# Altium project Airbrake Motor Controller.PrjPcb
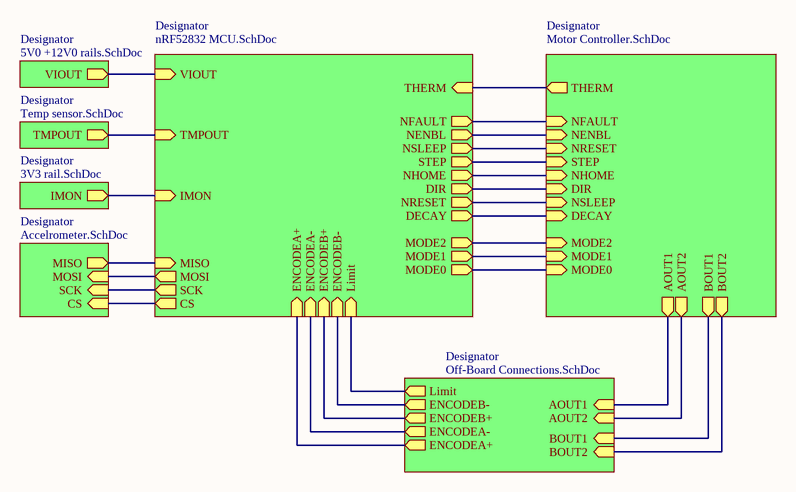
[diagram p0: Airbrake Motor Controller main.SchDoc]
8 sheets, 103 parts. Net scope: hierarchical (ports join the sheet entries above them; power ports are global).
Board file: Airbrake Motor Controller.PcbDoc
Sheets:
  Airbrake Motor Controller main.SchDoc
    Designator = 5V0 +12V0 rails.SchDoc
    Designator = 3V3 rail.SchDoc
    Designator = Motor Controller.SchDoc
    Designator = nRF52832 MCU.SchDoc
    Designator = Accelrometer.SchDoc
    Designator = Off-Board Connections.SchDoc
    Designator = Temp sensor.SchDoc

## Sheet Airbrake Motor Controller main.SchDoc
size A

### Sub-sheets
Designator = 5V0 +12V0 rails.SchDoc: VIOUT (out)
Designator = 3V3 rail.SchDoc: IMON (out)
Designator = Motor Controller.SchDoc: DIR (in), DECAY (in), NENBL (in), NFAULT (in), NHOME (in), NRESET (in), NSLEEP (in), STEP (in), MODE0 (in), MODE1 (in), MODE2 (in), THERM (out), BOUT1 (out), BOUT2 (out), AOUT1 (out), AOUT2 (out)
Designator = nRF52832 MCU.SchDoc: ENCODEA+ (in), ENCODEB+ (in), ENCODEA- (in), ENCODEB- (in), NFAULT (out), VIOUT (in), CS (out), NENBL (out), NSLEEP (out), STEP (out), SCK (out), MODE2 (out), MOSI (out), NHOME (out), MISO (in), TMPOUT (in), DIR (out), IMON (in), NRESET (out), MODE0 (out), THERM (in), DECAY (out), MODE1 (out), Limit (in)
Designator = Accelrometer.SchDoc: MOSI (in), CS (in), MISO (out), SCK (in)
Designator = Off-Board Connections.SchDoc: BOUT1 (in), ENCODEA- (out), ENCODEA+ (out), BOUT2 (in), ENCODEB- (out), ENCODEB+ (out), AOUT1 (in), AOUT2 (in), Limit (out)
Designator = Temp sensor.SchDoc: TMPOUT (out)

### Nets
NetC17_1: sheet Designator/TMPOUT, sheet Designator/TMPOUT
NetJ4_1: sheet Designator/AOUT1, sheet Designator/AOUT1
NetJ4_2: sheet Designator/AOUT2, sheet Designator/AOUT2
NetJ4_3: sheet Designator/BOUT2, sheet Designator/BOUT2
NetJ4_4: sheet Designator/BOUT1, sheet Designator/BOUT1
NetR2_1: sheet Designator/ENCODEA+, sheet Designator/ENCODEA+
NetR3_1: sheet Designator/ENCODEB+, sheet Designator/ENCODEB+
NetR6_1: sheet Designator/ENCODEA-, sheet Designator/ENCODEA-
NetR7_1: sheet Designator/ENCODEB-, sheet Designator/ENCODEB-
NetR27_2: sheet Designator/Limit, sheet Designator/Limit
NetR29_2: sheet Designator/NHOME, sheet Designator/NHOME
NetR30_2: sheet Designator/NFAULT, sheet Designator/NFAULT
NetU1_8: sheet Designator/MISO, sheet Designator/MISO
NetU1_9: sheet Designator/MOSI, sheet Designator/MOSI
NetU1_10: sheet Designator/SCK, sheet Designator/SCK
NetU1_11: sheet Designator/CS, sheet Designator/CS
NetU1_14: sheet Designator/MODE2, sheet Designator/MODE2
NetU1_15: sheet Designator/MODE1, sheet Designator/MODE1
NetU1_16: sheet Designator/MODE0, sheet Designator/MODE0
NetU1_17: sheet Designator/STEP, sheet Designator/STEP
NetU1_18: sheet Designator/NENBL, sheet Designator/NENBL
NetU1_19: sheet Designator/DIR, sheet Designator/DIR
NetU1_20: sheet Designator/DECAY, sheet Designator/DECAY
NetU1_23: sheet Designator/NSLEEP, sheet Designator/NRESET
NetU1_27: sheet Designator/NRESET, sheet Designator/NSLEEP
(unnamed): sheet Designator/VIOUT, sheet Designator/VIOUT
(unnamed): sheet Designator/IMON, sheet Designator/IMON
(unnamed): sheet Designator/THERM, sheet Designator/THERM

## Sheet 5V0 +12V0 rails.SchDoc
size A
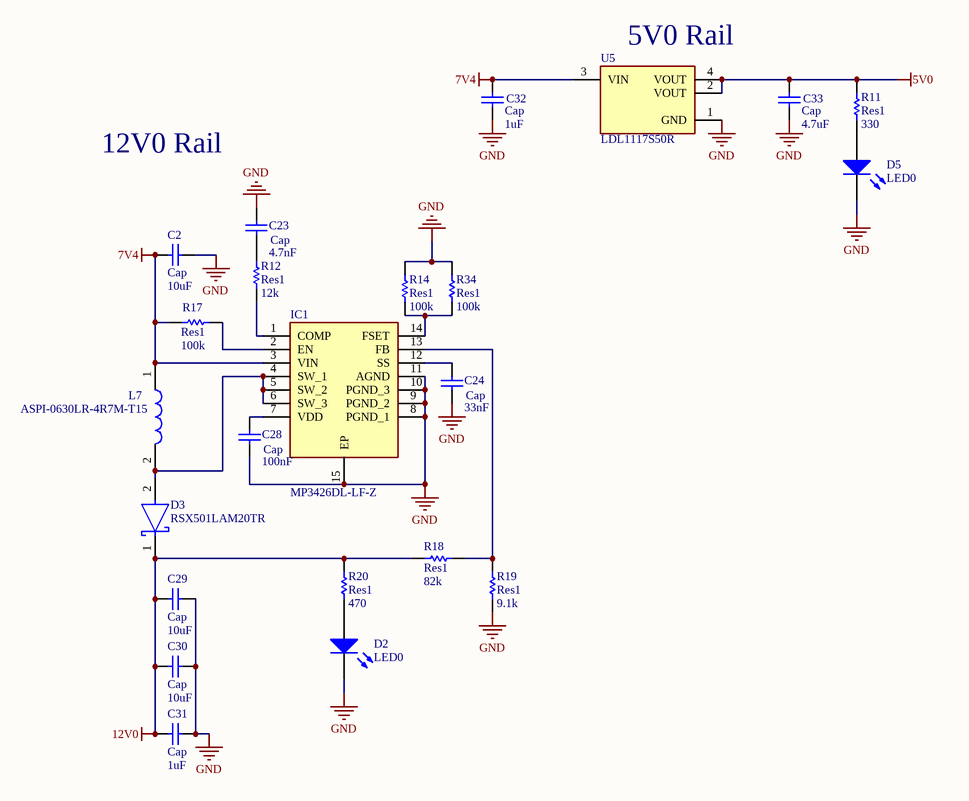
[diagram p1: 5V0 +12V0 rails.SchDoc]

### Parts
C2  Cap  value 10uF  [6-0805_M]
C23  Cap  value 4.7nF  [0402-A]
C24  Cap  value 33nF  [0402-A]
C28  Cap  value 100nF  [1608[0603]]
C29  Cap  value 10uF  [6-0805_M]
C30  Cap  value 10uF  [6-0805_M]
C31  Cap  value 1uF  [1608[0603]]
C32  Cap  value 1uF  [1608[0603]]
C33  Cap  value 4.7uF  [1608[0603]]
D2  LED0  [1608[0603]]
D3  RSX501LAM20TR  [FP-PMDTM-MFG]
D5  LED0  [1608[0603]]
IC1  MP3426DL-LF-Z  [SON50P300X400X100-15N-D]
L7  ASPI-0630LR-4R7M-T15  [ASPI-0630LR]
R11  Res1  value 330  [0402-A]
R12  Res1  value 12k  [0402-A]
R14  Res1  value 100k  [0402-A]
R17  Res1  value 100k  [0402-A]
R18  Res1  value 82k  [0402-A]
R19  Res1  value 9.1k  [0402-A]
R20  Res1  value 470  [6-0805_M]
R34  Res1  value 100k  [0402-A]
U5  LDL1117S50R  [FP-SOT-223-0046067_14-MFG]

### Nets
5V0: C33.2 R11.2 U5.2(VOUT) U5.4(VOUT)
7V4: C2.2 C32.2 IC1.3(VIN) L7.1 R17.2 U5.3(VIN)
12V0: C29.2 C30.2 C31.2 D3.1(C) R18.2 R20.2
GND: C2.1 C23.2 C24.1 C28.1 C29.1 C30.1 C31.1 C32.1 C33.1 D2.2(K) D5.2(K) IC1.8(PGND_1) IC1.9(PGND_2) IC1.10(PGND_3) IC1.11(AGND) IC1.15(EP) R14.1 R19.1 R34.1 U5.1(GND)
NetC23_1: C23.1 R12.1
NetC24_2: C24.2 IC1.12(SS)
NetC28_2: C28.2 IC1.7(VDD)
NetD2_1: D2.1(A) R20.1
NetD3_2: D3.2(A) IC1.4(SW_1) IC1.5(SW_2) IC1.6(SW_3) L7.2
NetD5_1: D5.1(A) R11.1
NetIC1_1: IC1.1(COMP) R12.2
NetIC1_2: IC1.2(EN) R17.1
NetIC1_13: IC1.13(FB) R18.1 R19.2
NetIC1_14: IC1.14(FSET) R14.2 R34.2

### Notes on the sheet
- (near U5) 5V0 Rail
- 12V0 Rail

### Library data of the parts
C2 C23 C24 C28-C33 = Cap: Capacitor; Published: 8-Jun-2000; LatestRevisionDate: 17-Jul-2002; LatestRevisionNote: Re-released for DXP Platform.; PackageReference: RAD-0.3; Publisher: Altium Limited; PackageDescription: Radial Cap, Thru-Hole; 2 Leads; 0.3 in Pin Spacing
D3 = CMP-08971-000008-1: DIODE SCHOTTKY 20V 5A PMDTM; Manufacturer: Rohm; Max Surge Forward Current: 100A; Max Junction Temp: +125°C; Max Repetitive Reverse Voltage: 25V; Peak Reverse Current: 500uA; Automotive: No; Digikey Description: DIODE SCHOTTKY 20V 5A PMDTM; Temperature Range High: +125°C; Height: 1.05mm; Octopart: https://octopart.com/rsx501lam20tr-rohm-82270774; Lead Free: Yes; ComponentLink2URL: https://fscdn.rohm.com/en/products/databook/datasheet/discrete/diode/schottky_barrier/rsx501lam20tr-e.pdf; Device Class L2: Diodes; ComponentLink2Description: Datasheet; Device Class L1: Discrete Semiconductors; RoHS: TRUE; Reverse Voltage: 20V; Package: PMDTM; Category: Diode; Temperature: to +125°C; Device Class L3: Schottky Diodes; Manufacturer Part Number: RSX501LAM20TR; Forward Current: 5A
IC1 = MP3426DL-LF-Z: Integrated Circuit; Manufacturer_Name: Monolithic Power Systems (MPS); Datasheet Link: https://www.monolithicpower.com/en/documentview/productdocument/index/version/2/document_type/Datasheet/lang/en/sku/MP3426/; Height: 1mm; Manufacturer_Part_Number: MP3426DL-LF-Z; Mouser Part Number: 946-MP3426DL-LF-Z; Mouser Price/Stock: https://www.mouser.co.uk/ProductDetail/Monolithic-Power-Systems-MPS/MP3426DL-LF-Z?qs=Z3CaLxJiOJL0MxCuEKYvhQ%3D%3D
L7 = ASPI-0630LR-4R7M-T15: Inductor; Manufacturer_Name: ABRACON; Datasheet Link: http://www.abracon.com/Magnetics/power/ASPI-0630LR.pdf; Manufacturer_Part_Number: ASPI-0630LR-4R7M-T15; Mouser Part Number: 815-ASPI0630LR4R7T15; Mouser Price/Stock: https://www.mouser.co.uk/ProductDetail/ABRACON/ASPI-0630LR-4R7M-T15?qs=bWAYEm3xoCYVuRmkzS1c6A%3D%3D; Arrow Part Number: ASPI-0630LR-4R7M-T15; Arrow Price/Stock: https://www.arrow.com/en/products/aspi-0630lr-4r7m-t15/abracon
R11 R12 R14 R17-R20 R34 = Res1: Resistor; Published: 8-Jun-2000; LatestRevisionDate: 17-Jul-2002; LatestRevisionNote: Re-released for DXP Platform.; PackageReference: AXIAL-0.3; Publisher: Altium Limited; PackageDescription: Axial Device, Thru-Hole; 2 Leads; 0.3 in Pin Spacing
U5 = CMP-12153-000005-1: IC REG LINEAR 5V 1.2A SOT223; Manufacturer: STMicroelectronics; Standoff Height: 0.02mm; Min Supply Voltage: 2.6V; Nominal Supply Current: 250uA; Max Junction Temp: +150°C; Accuracy Percentage: 2%; Output Type: Fixed; Max Supply Voltage: 18V; Output Current: 2A; Number Of Outputs: 1; Dropout Voltage: 350mV; ComponentLink2Description: Datasheet; Temperature Range High: +125°C; Manufacturer Part Number: LDL1117S50R; Digikey Description: IC REG LINEAR 5V 1.2A SOT223; Device Class L2: Power Management ICs; RoHS: TRUE; Temperature: -40°C to +125°C; Device Class L3: Voltage Regulators - Linear; Automotive: No; Mouser Description: LDL1117 Series 1.2 A 5 V High PSRR LDO Linear Voltage Regulator - SOT-223; Package: SOT-223-0046067_14; ComponentLink2URL: https://www.st.com/content/ccc/resource/technical/document/datasheet/group3/0e/5a/00/ca/10/1a/4f/a5/DM00366442/files/DM00366442.pdf/jcr:content/translations/en.DM00366442.pdf; Output Voltage: 5V; Octopart: https://octopart.com/ldl1117s50r-stmicroelectronics-81876164; Category: IC; Device Class L1: Integrated Circuits (ICs); Temperature Range Low: -40°C; Height: 1.9mm; Lead Free: Yes
D2 D5 = LED0: Published: 8-Jun-2000; LatestRevisionDate: 08-Jul-2005; LatestRevisionNote: Mech Layer 1 removed.; PackageReference: LED-0; Publisher: Altium Limited; PackageDescription: LED; 2 Leads

## Sheet 3V3 rail.SchDoc
size A
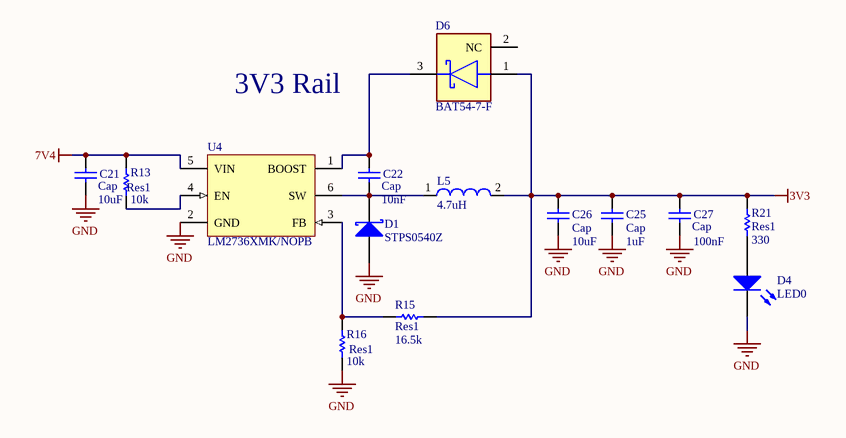
[diagram p2: 3V3 rail.SchDoc]

### Parts
C21  Cap  value 10uF  [6-0805_M]
C22  Cap  value 10nF  [0402-A]
C25  Cap  value 1uF  [1608[0603]]
C26  Cap  value 10uF  [6-0805_M]
C27  Cap  value 100nF  [1608[0603]]
D1  STPS0540Z  [STM-SOD-123-2_V]
D4  LED0  [1608[0603]]
D6  BAT54-7-F  [FP-SOT23-MFG]
L5  4.7uH  [WE-TPC-4818-M]
R13  Res1  value 10k  [0402-A]
R15  Res1  value 16.5k  [0402-A]
R16  Res1  value 10k  [0402-A]
R21  Res1  value 330  [0402-A]
U4  LM2736XMK/NOPB  [DDC0006A_L]

### Nets
3V3: C25.2 C26.2 C27.2 D6.1(A) L5.2 R15.1 R21.2
7V4: C21.2 R13.2 U4.5(VIN)
GND: C21.1 C25.1 C26.1 C27.1 D1.1(A) D4.2(K) R16.1 U4.2(GND)
NetC22_1: C22.1 D1.2(K) L5.1 U4.6(SW)
NetC22_2: C22.2 D6.3(C) U4.1(BOOST)
NetD4_1: D4.1(A) R21.1
NetR13_1: R13.1 U4.4(EN)
NetR15_2: R15.2 R16.2 U4.3(FB)

Not connected (* = marked no-connect by the designer): D6 2(NC)

### Notes on the sheet
- 3V3 Rail

### Library data of the parts
C21 C22 C25-C27 = Cap: Capacitor; Published: 8-Jun-2000; LatestRevisionDate: 17-Jul-2002; LatestRevisionNote: Re-released for DXP Platform.; PackageReference: RAD-0.3; Publisher: Altium Limited; PackageDescription: Radial Cap, Thru-Hole; 2 Leads; 0.3 in Pin Spacing
D1 = CMP-2000-07170-1: Schottky Rectifier, 0.5 A, 40 V, 2-Pin SOP (SOD-123), RoHS, Tape and Reel; Manufacturer: STMicroelectronics; SVHC: NoSVHC(15-Jun-2015); Forward Current If(AV): 500mA; Forward Voltage VF Max: 500mV; Repetitive Reverse Voltage Vrrm Max: 40V; No. of Pins: 2Pins; Forward Surge Current Ifsm Max: 5.5A; Diode Configuration: Single; Packaging: CutTape; Datasheet Version: 01/2002; Package Reference: SOD-123-2; Package Description: 2-Pin Small Outline Diode, Body 2.7 x 1.55 mm; Manufacturer URL: http://www.st.com/; Mounting Technology: SurfaceMount; Product Range: -; Operating Temperature Max: 150°C; Diode Case Style: SOD-123; Diode Type: Schottky; Datasheet URL: http://www.st.com/content/ccc/resource/technical/document/datasheet/group1/0f/03/9b/7c/50/58/48/d7/CD00001852/files/CD00001852.pdf/jcr:content/translations/en.CD00001852.pdf
D6 = CMP-0303-00002-2: DIODE SCHOTTKY 30V 200MA SOT23-3; Manufacturer: Diodes Inc.; Value: 10pF; Automotive Grade: NA; Max Junction Temp: +150°C; Peak Reverse Current: 2uA; Max Surge Forward Current: 600mA; Standoff Height: 0.013mm; Max Repetitive Reverse Voltage: 30V; Automotive: No; Package: SOT23; Category: Diode; Digikey Description: DIODE SCHOTTKY 30V 200MA SOT23-3; RoHS: TRUE; Temperature Range Low: -65°C; Device Class L3: Schottky Diodes; Footprint Url: https://www.diodes.com/assets/Package-Files/SOT23.pdf; Forward Current: 200mA; Reverse Voltage: 30V; Manufacturer Part Number: BAT54-7-F; Octopart: https://octopart.com/bat54-7-f-diodes+inc.-39681803; Lead Free: Yes; Temperature Range High: +150°C; ComponentLink2Description: Datasheet; Height: 1.1mm; Capacitance: 10pF; ComponentLink2URL: https://www.diodes.com/assets/Datasheets/ds11005.pdf; Temperature: -65°C to +150°C; Device Class L1: Discrete Semiconductors; Device Class L2: Diodes; Mouser Description: Switching diode SOT-23 30 V 200 mA
L5 = CMP-0227-00330-1: SMD Shielded Tiny Power Inductor WE-TPC, L = 4.70 µH; Inductance: 4.70 ÂµH; PackageVersion: 2010; ComponentLink2Description: Datasheet; ComponentLink2URL: http://www.we-online.de/katalog/media/pdf/744042004.pdf; PackageDescription: SMD Inductor, 2-Leads, Body 4.8 x 4.8 mm; ComponentLink1URL: http://www.we-online.com; PackageReference: WE-TPC-4818-M; ComponentLink1Description: Manufacturer Link; DatasheetVersion: ver 6, Aug-2010
R13 R15 R16 R21 = Res1: Resistor; Published: 8-Jun-2000; LatestRevisionDate: 17-Jul-2002; LatestRevisionNote: Re-released for DXP Platform.; PackageReference: AXIAL-0.3; Publisher: Altium Limited; PackageDescription: Axial Device, Thru-Hole; 2 Leads; 0.3 in Pin Spacing
U4 = CMP-0069-01211-3: 750mA Load Step-Down DC-DC Regulator, 6-pin Tiny SOT23, Pb-Free; Manufacturer: Texas Instruments; PowerWise: N; CompType: Switcher; PackageTopMarking: SHAB*XTT; Code_IPC: SOT26A-6; PackageDescription: Molded TSOT, 2.97 x 1.65 x 0.87mm Body, 6 Lead, 0.95mm Pitch; ComponentLink1Description: Datasheet URL; RoHS: Y; ComponentLink1URL: http://www.ti.com/general/docs/lit/getliterature.tsp?genericPartNumber=LM2736&fileType=pdf; PinCount: 6; PackageReference: DDC0006A; Code_JEDEC: MO-193-AA
D4 = LED0: Published: 8-Jun-2000; LatestRevisionDate: 08-Jul-2005; LatestRevisionNote: Mech Layer 1 removed.; PackageReference: LED-0; Publisher: Altium Limited; PackageDescription: LED; 2 Leads

## Sheet Motor Controller.SchDoc
size A
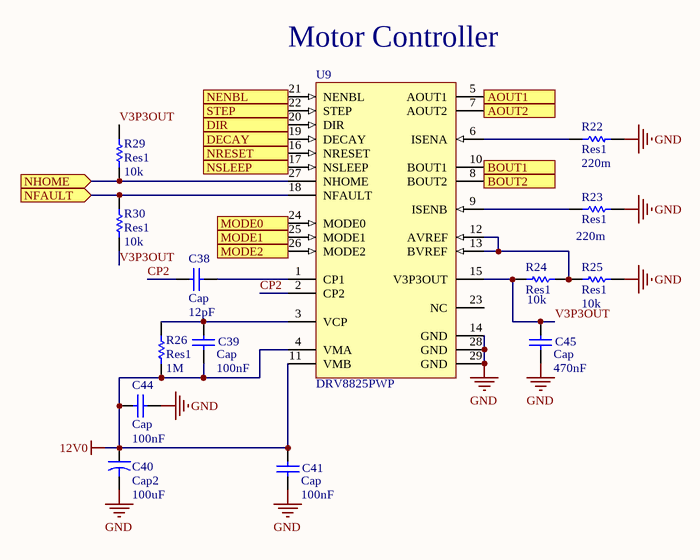
[diagram p3: Motor Controller.SchDoc]

### Parts
C38  Cap  value 12pF  [0402-A]
C39  Cap  value 100nF  [1608[0603]]
C40  Cap2  value 100uF  [RAD-0.1]
C41  Cap  value 100nF  [1608[0603]]
C44  Cap  value 100nF  [1608[0603]]
C45  Cap  value 470nF  [1608[0603]]
R22  Res1  value 220m  [RC2512N_PAN]
R23  Res1  value 220m  [RC2512N_PAN]
R24  Res1  value 10k  [0402-A]
R25  Res1  value 10k  [0402-A]
R26  Res1  value 1M  [0402-A]
R29  Res1  value 10k  [0402-A]
R30  Res1  value 10k  [0402-A]
U9  DRV8825PWP  [PWP0028C_L]

### Ports
AOUT1 (out), AOUT2 (out), BOUT1 (out), BOUT2 (out), DECAY (in), DIR (in), MODE0 (in), MODE1 (in), MODE2 (in), NENBL (in), NFAULT (in), NHOME (in), NRESET (in), NSLEEP (in), STEP (in)

### Nets
12V0: C39.1 C40.1 C41.2 C44.2 R26.1 U9.4(VMA) U9.11(VMB)
GND: C40.2 C41.1 C44.1 C45.1 R22.1 R23.1 R25.2 U9.14(GND) U9.28(GND) U9.29(GND)
CP2: C38.2 U9.2(CP2)
V3P3OUT: C45.2 R24.2 R29.1 R30.1 U9.15(V3P3OUT)
NetC38_1: C38.1 U9.1(CP1)
NetC39_2: C39.2 R26.2 U9.3(VCP)
NetJ4_1: U9.5(AOUT1) ; port AOUT1
NetJ4_2: U9.7(AOUT2) ; port AOUT2
NetJ4_3: U9.8(BOUT2) ; port BOUT2
NetJ4_4: U9.10(BOUT1) ; port BOUT1
NetR22_2: R22.2 U9.6(ISENA)
NetR23_2: R23.2 U9.9(ISENB)
NetR24_1: R24.1 R25.1 U9.12(AVREF) U9.13(BVREF)
NetR29_2: R29.2 U9.27(NHOME) ; port NHOME
NetR30_2: R30.2 U9.18(NFAULT) ; port NFAULT
NetU1_14: U9.26(MODE2) ; port MODE2
NetU1_15: U9.25(MODE1) ; port MODE1
NetU1_16: U9.24(MODE0) ; port MODE0
NetU1_17: U9.22(STEP) ; port STEP
NetU1_18: U9.21(NENBL) ; port NENBL
NetU1_19: U9.20(DIR) ; port DIR
NetU1_20: U9.19(DECAY) ; port DECAY
NetU1_23: U9.17(NSLEEP) ; port NSLEEP
NetU1_27: U9.16(NRESET) ; port NRESET

Not connected (* = marked no-connect by the designer): U9 23(NC)

### Notes on the sheet
- (near U9) Motor Controller

### Library data of the parts
C38 C39 C41 C44 C45 = Cap: Capacitor; Published: 8-Jun-2000; LatestRevisionDate: 17-Jul-2002; LatestRevisionNote: Re-released for DXP Platform.; PackageReference: RAD-0.3; Publisher: Altium Limited; PackageDescription: Radial Cap, Thru-Hole; 2 Leads; 0.3 in Pin Spacing
C40 = Cap2: Capacitor; Published: 23-Sep-2002; PackageReference: CAPR5-4X5; Publisher: Altium Limited; PackageDescription: Capacitor; 2 Leads
R22-R26 R29 R30 = Res1: Resistor; Published: 8-Jun-2000; LatestRevisionDate: 17-Jul-2002; LatestRevisionNote: Re-released for DXP Platform.; PackageReference: AXIAL-0.3; Publisher: Altium Limited; PackageDescription: Axial Device, Thru-Hole; 2 Leads; 0.3 in Pin Spacing
U9 = CMP-1685-00019-1: Stepper Motor Controller IC, 8.2 to 45 V, -40 to 85 degC, 28-Pin HTSSOP (PWP), Green (RoHS & no Sb/Br), Tube; Voltage Rating: 100 V; Tolerance: 20%; Capacitance: 47 uF; Case\Package: Radial; ComponentLink2URL: http://www.ti.com/general/docs/lit/getliterature.tsp?genericPartNumber=DRV8825&fileType=pdf; Voltage Rating (DC): 100 V; Lead Pitch: 3.5 mm; Diameter: 8 mm; DatasheetVersion: SLVSA73F, 07/2014; ComponentLink2Description: Datasheet; Package Quantity: 200; PackageDescription: 28-Pin Small Outline Package Integrated Circuit, Body 9.7 x 4.4 mm, Pitch 0.65 mm; Packaging: Bulk; Pins: 2; Min Operating Temperature: -40 degC; Width: 8 mm; ComponentLink1Description: Manufacturer URL; Length: 11.5 mm; Max Operating Temperature: 85 degC; Height: 11.5 mm; REACH SVHC: No SVHC; Mount: Through Hole; PackageReference: PWP0028C; RoHSCompliant: true; Radiation Hardening: No; ComponentLink1URL: http://www.ti.com/

## Sheet nRF52832 MCU.SchDoc
size A
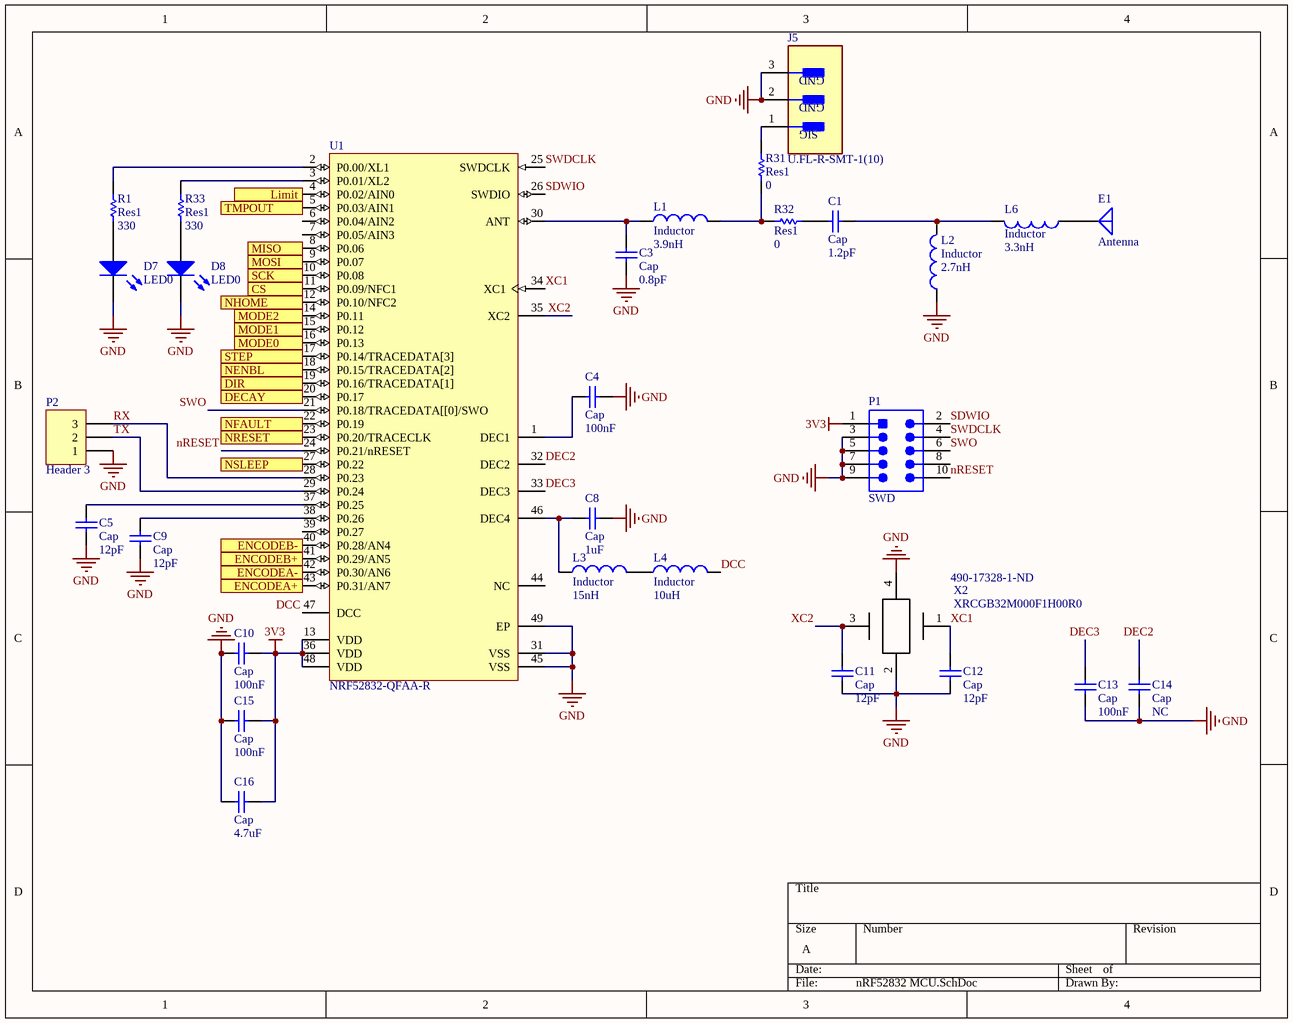
[diagram p4: nRF52832 MCU.SchDoc]

### Parts
C1  Cap  value 1.2pF  [0402-A]
C3  Cap  value 0.8pF  [0402-A]
C4  Cap  value 100nF  [1608[0603]]
C5  Cap  value 12pF  [0402-A]
C8  Cap  value 1uF  [1608[0603]]
C9  Cap  value 12pF  [0402-A]
C10  Cap  value 100nF  [1608[0603]]
C11  Cap  value 12pF  [0402-A]
C12  Cap  value 12pF  [0402-A]
C13  Cap  value 100nF  [1608[0603]]
C14  Cap  value NC  [0402-A]
C15  Cap  value 100nF  [1608[0603]]
C16  Cap  value 4.7uF  [6-0805_M]
D7  LED0  [1608[0603]]
D8  LED0  [1608[0603]]
E1  Antenna  [3.2X1.6X1.1]
J5  U.FL-R-SMT-1(10)  [FP-U_FL-R-SMT-1_10-MFG]
L1  Inductor  value 3.9nH  [0402-A]
L2  Inductor  value 2.7nH  [0402-A]
L3  Inductor  value 15nH  [0402-A]
L4  Inductor  value 10uH  [1608[0603]]
L6  Inductor  value 3.3nH  [0402-A]
P1  SWD  [SMTC-FTSH-105-01-L-DV-K_V]
P2  Header 3  [HDR1X3]
R1  Res1  value 330  [0402-A]
R31  Res1  value 0  [0402-A]
R32  Res1  value 0  [0402-A]
R33  Res1  value 330  [0402-A]
U1  NRF52832-QFAA-R  [NRSC-QF-48_M]
X2  XRCGB32M000F1H00R0  Supplier Part Number 1: 490-17328-1-ND  [XRCGB32M000F1H00R0]

### Ports
CS (out), DECAY (out), DIR (out), ENCODEA+ (in), ENCODEA- (in), ENCODEB+ (in), ENCODEB- (in), Limit (in), MISO (in), MODE0 (out), MODE1 (out), MODE2 (out), MOSI (out), NENBL (out), NFAULT (out), NHOME (out), NRESET (out), NSLEEP (out), SCK (out), STEP (out), TMPOUT (in)

### Nets
3V3: C10.1 C15.1 C16.1 P1.1 U1.13(VDD) U1.36(VDD) U1.48(VDD)
GND: C3.1 C4.1 C5.2 C8.1 C9.2 C10.2 C11.1 C12.1 C13.2 C14.2 C15.2 C16.2 D7.2(K) D8.2(K) J5.2(GND) J5.3(GND) L2.1 P1.3 P1.5 P1.7 P1.9 P2.1 U1.31(VSS) U1.45(VSS) U1.49(EP) X2.2 X2.4
DCC: L4.2 U1.47(DCC)
DEC2: C14.1 U1.32(DEC2)
DEC3: C13.1 U1.33(DEC3)
nRESET: P1.10 U1.24(P0.21/nRESET)
RX: P2.3 U1.28(P0.23)
SDWIO: P1.2 U1.26(SWDIO)
SWDCLK: P1.4 U1.25(SWDCLK)
SWO: P1.6 U1.21(P0.18/TRACEDATA[[0]/SWO)
TX: P2.2 U1.29(P0.24)
XC1: C12.2 U1.34(XC1) X2.1
XC2: C11.2 U1.35(XC2) X2.3
NetC1_1: C1.1 L2.2 L6.2
NetC1_2: C1.2 R32.2
NetC3_2: C3.2 L1.1 U1.30(ANT)
NetC4_2: C4.2 U1.1(DEC1)
NetC5_1: C5.1 U1.37(P0.25)
NetC8_2: C8.2 L3.1 U1.46(DEC4)
NetC9_1: C9.1 U1.38(P0.26)
NetC17_1: U1.5(P0.03/AIN1) ; port TMPOUT
NetD7_1: D7.1(A) R1.1
NetD8_1: D8.1(A) R33.1
NetE1_1: E1.1(A) L6.1
NetJ5_1: J5.1(SIG) R31.2
NetL1_2: L1.2 R31.1 R32.1
NetL3_2: L3.2 L4.1
NetR1_2: R1.2 U1.2(P0.00/XL1)
NetR2_1: U1.43(P0.31/AN7) ; port ENCODEA+
NetR3_1: U1.41(P0.29/AN5) ; port ENCODEB+
NetR6_1: U1.42(P0.30/AN6) ; port ENCODEA-
NetR7_1: U1.40(P0.28/AN4) ; port ENCODEB-
NetR27_2: U1.4(P0.02/AIN0) ; port Limit
NetR29_2: U1.12(P0.10/NFC2) ; port NHOME
NetR30_2: U1.22(P0.19) ; port NFAULT
NetR33_2: R33.2 U1.3(P0.01/XL2)
NetU1_8: U1.8(P0.06) ; port MISO
NetU1_9: U1.9(P0.07) ; port MOSI
NetU1_10: U1.10(P0.08) ; port SCK
NetU1_11: U1.11(P0.09/NFC1) ; port CS
NetU1_14: U1.14(P0.11) ; port MODE2
NetU1_15: U1.15(P0.12) ; port MODE1
NetU1_16: U1.16(P0.13) ; port MODE0
NetU1_17: U1.17(P0.14/TRACEDATA[3]) ; port STEP
NetU1_18: U1.18(P0.15/TRACEDATA[2]) ; port NENBL
NetU1_19: U1.19(P0.16/TRACEDATA[1]) ; port DIR
NetU1_20: U1.20(P0.17) ; port DECAY
NetU1_23: U1.23(P0.20/TRACECLK) ; port NRESET
NetU1_27: U1.27(P0.22) ; port NSLEEP

Not connected (* = marked no-connect by the designer): P1 8; U1 6(P0.04/AIN2) 7(P0.05/AIN3) 39(P0.27) 44(NC)

### Library data of the parts
C1 C3-C5 C8-C16 = Cap: Capacitor; Published: 8-Jun-2000; LatestRevisionDate: 17-Jul-2002; LatestRevisionNote: Re-released for DXP Platform.; PackageReference: RAD-0.3; Publisher: Altium Limited; PackageDescription: Radial Cap, Thru-Hole; 2 Leads; 0.3 in Pin Spacing
E1 = Antenna: Generic Antenna; Published: 24-Mar-1999; LatestRevisionDate: 17-Jul-2002; LatestRevisionNote: Re-released for DXP Platform.; PackageReference: PIN1; Publisher: Altium Limited
J5 = CMP-2000-05152-2: CONN U.FL RCPT STR 50 OHM SMD; Body Plating: Silver; Impedance: 50R; Frequency: 6GHz; Connector Type: Coaxial; Dielectric Material: Polymer; Insulation Resistance: 500MR; Body Material: Bronze; Gender: Male; REACH SVHC: No SVHC; Depth: 3.1mm; Housing Color: Beige; Contact Material: Brass; Package Quantity: 2500; Max Frequency: 6GHz; Radiation Hardening: No; Packaging: Tape and Reel; Termination: Solder; Lead Free: Lead Free; Wire/Cable Type: Coaxial; Min Operating Temperature: -40°C; Max Operating Temperature: 90°C; Contact Plating: Gold; Mount: Surface Mount; Fastening Type: Snap; Orientation: Straight; Length: 3mm
L1-L4 L6 = Inductor: Code_IEC: 1005; Published: 8-Jun-2000; LatestRevisionDate: 29-May-2009; LatestRevisionNote: IPC-7351 Footprint Added.; PackageReference: 0402-A; Publisher: Altium Limited; PackageDescription: Chip Inductor; Code_JEITA: 0402
P1 = CMP-2000-05353-1: Male Header, Pitch 1.27 mm, 2 x 5 Position, Height 6.25 mm; Manufacturer: Samtec; Pitch: 0.050"(1.27mm); Other Names: Q3937619; Number of Positions: 10; Mating Products: SFMC-105-L2-S-D-TR-ND / -CONN.05"SURFACE10POSSMT / FLE-105-01-G-DV-TR-ND / -CONNSKT1.27MM10POSDUALSMD / FLE-105-01-G-DV-A-P-ND / -CONNSKT1.27MM10POSDUALSMD / FLE-105-01-G-DV-A-ND / -CONNSKT1.27MM10POSDUALSMD / CLP-105-02-G-D-P-TR-ND / -CONNRCPT10POSDUAL.05"SMD / SAM1155-05-ND / -CONNRCPT10POSDUAL.05"SMD / SAM1154-05-ND / -CONNRCPT10POSDUAL.05"SMD / SAM1153-05-ND / -CONNRCPT10POSDUAL.05"SMD / SAM1226-05-ND / -CONNRCPT.05"10POSDUALSMD; Number of Positions Loaded: All; Connector Type: Header,Unshrouded; Product Training Modules: Board-to-BoardConnectors; Datasheet Version: Rev. ET, 10/1995; Number of Rows: 2; Standard Package: 1; Package Description: Male Header, Pitch 1.27 mm, 2 x 5 Position, Height 5.97 mm, Tail Length 4.32 mm; Contact Finish Thickness: 10µin(0.25µm); Series: FTSH; Termination: Solder; Contact Type: MalePin; Color: Black; Package Reference: FTSH-105-01-L-DV-K; Family: RectangularConnectors-Headers,MalePins; Package URL: http://suddendocs.samtec.com/prints/ftsh-1xx-xx-xxx-dv-xxx-footprint.pdf; Packaging: Tube; Mounting Type: SurfaceMount; Category: Connectors,Interconnects; Datasheet URL: http://suddendocs.samtec.com/prints/ftsh-1xx-xx-xxx-dv-xxx-mkt.pdf; Row Spacing: 0.050"(1.27mm); Manufacturer URL: http://www.samtec.com/; Contact Mating Length: 0.120"(3.05mm); Contact Finish: Gold
P2 = Header 3: Header, 3-Pin; LatestRevisionDate: 17-Jul-2002; LatestRevisionNote: Re-released for DXP Platform.; Publisher: Altium Limited
R1 R31-R33 = Res1: Resistor; Published: 8-Jun-2000; LatestRevisionDate: 17-Jul-2002; LatestRevisionNote: Re-released for DXP Platform.; PackageReference: AXIAL-0.3; Publisher: Altium Limited; PackageDescription: Axial Device, Thru-Hole; 2 Leads; 0.3 in Pin Spacing
U1 = CMP-2100-03661-1: Multiprotocol Bluetooth Smart, ANT/ANT+ and Proprietary System-on-Chip, 2.4 GHz, 256 KB FLASH, 1.7 to 3.6 V, -40 to 85 degC, 48-Pin QFN, RoHS, Tape and Reel; Manufacturer: Nordic Semiconductor; Frequency: 2.4GHz; Datasheet Version: Rev. 1.0, 02/2016; Datasheet URL: http://infocenter.nordicsemi.com/pdf/nRF52832_PS_v1.0.pdf; Mount: SurfaceMount; Max Operating Temperature: 85degC; Manufacturer URL: http://www.nordicsemi.com/eng/Products/; Lead Free: LeadFree; Min Operating Temperature: -40degC; RoHSCompliant: true; Package Reference: QF-48; Package Description: 48-Pin Quad Flat No-lead Package, Body 6 x 6 mm, Pitch 0.4 mm, Thermal Pad 4.6 x 4.6 mm; Max Frequency: 2.4GHz; Packaging: TapeandReel
X2 = XRCGB32M000F1H00R0: 32MHz Crystal Oscillator; Supplier 1: Digi-Key
D7 D8 = LED0: Published: 8-Jun-2000; LatestRevisionDate: 08-Jul-2005; LatestRevisionNote: Mech Layer 1 removed.; PackageReference: LED-0; Publisher: Altium Limited; PackageDescription: LED; 2 Leads

## Sheet Accelrometer.SchDoc
size A
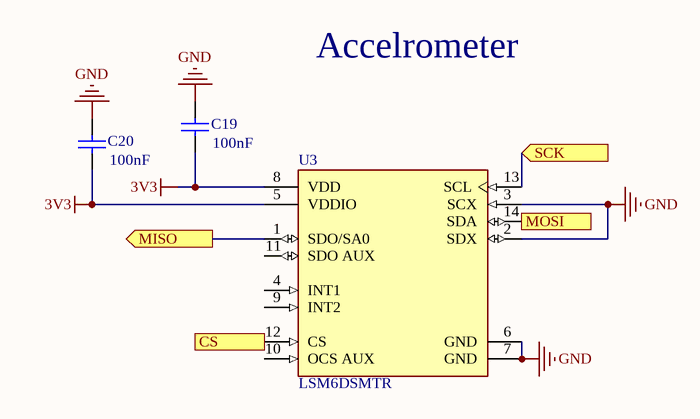
[diagram p5: Accelrometer.SchDoc]

### Parts
C19  value 100nF  [1608[0603]]  (hidden comment: Cap)
C20  value 100nF  [1608[0603]]  (hidden comment: Cap)
U3  LSM6DSMTR  [FP-LGA-14L-DM00249496-MFG]

### Ports
CS (in), MISO (out), MOSI (in), SCK (in)

### Nets
3V3: C19.2 C20.2 U3.5(VDDIO) U3.8(VDD)
GND: C19.1 C20.1 U3.2(SDX) U3.3(SCX) U3.6(GND) U3.7(GND)
NetU1_8: U3.1(SDO/SA0) ; port MISO
NetU1_9: U3.14(SDA) ; port MOSI
NetU1_10: U3.13(SCL) ; port SCK
NetU1_11: U3.12(CS) ; port CS

Not connected (* = marked no-connect by the designer): U3 4(INT1) 9(INT2) 10(OCS_AUX) 11(SDO_AUX)

### Notes on the sheet
- Accelrometer

### Library data of the parts
C19 C20 = Cap: Capacitor; Published: 8-Jun-2000; LatestRevisionDate: 17-Jul-2002; LatestRevisionNote: Re-released for DXP Platform.; PackageReference: RAD-0.3; Publisher: Altium Limited; PackageDescription: Radial Cap, Thru-Hole; 2 Leads; 0.3 in Pin Spacing
U3 = CMP-12177-000008-1: IMU ACCEL/GYRO I2C/SPI 14LGA; Manufacturer: STMicroelectronics; Operating Supply Current: 0.29-0.65mA; Gyro Range: 125/250/500/1000/2000°/s; Sensor Output: I2C,SPI; Accel Range: 2/4/8/16g; Min Supply Voltage: 1.62V; Resolution: 16bits; Sensor Type: Temperature,Accelerometer,Gyroscope; Max Supply Voltage: 3.6V; Manufacturer Part Number: LSM6DSMTR; Octopart: https://octopart.com/lsm6dsmtr-stmicroelectronics-66358194; Height: 0.86mm; Category: IC; Lead Free: Yes; Temperature: -40°C to +85°C; Temperature Range Low: -40°C; ComponentLink2Description: Datasheet; ComponentLink2URL: https://www.st.com/resource/en/datasheet/lsm6dsm.pdf; Digikey Description: IMU ACCEL/GYRO I2C/SPI 14LGA; Footprint Url: https://www.st.com/content/ccc/resource/technical/document/technical_note/73/17/9c/16/dd/96/4a/01/CD00134799.pdf/files/CD00134799.pdf/jcr:content/translations/en.CD00134799.pdf; Device Class L1: Sensors; Device Class L2: Motion Sensors; Temperature Range High: +85°C; Mouser Description: LSM6DSM Series 3.6 V I2C/SPI 3D Accelerometer and 3D Gyroscope - LGA-14; Device Class L3: Inertial Measurement Units (IMUs); Automotive: No; Package: LGA-14L-DM00249496; RoHS: TRUE

## Sheet Off-Board Connections.SchDoc
size A
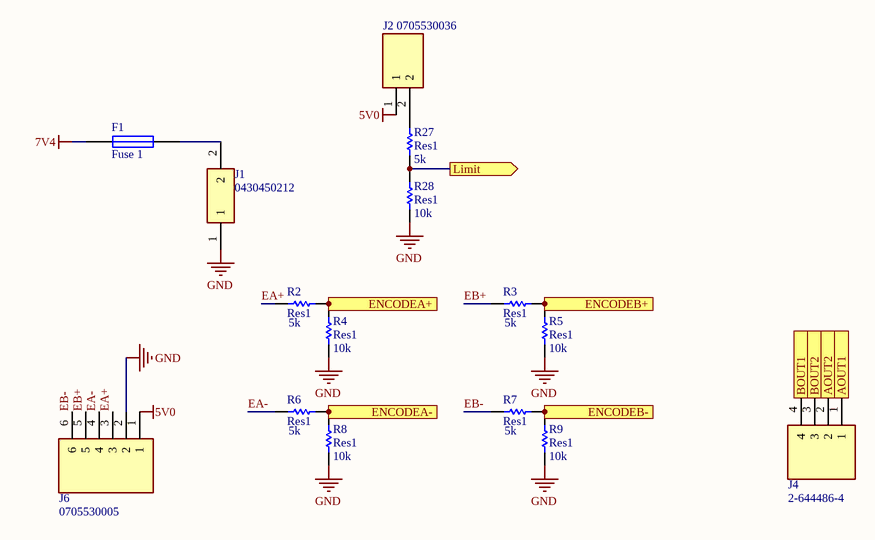
[diagram p6: Off-Board Connections.SchDoc]

### Parts
F1  Fuse 1  [C1206]
J1  0430450212  [0430450212]
J2  0705530036  [SHDRRA2W64P0X254_1X2_737X1359X699P]
J4  2-644486-4  [26444864]
J6  0705530005  [SHDRRA6W64P0X254_1X6_1779X1359X699P]
R2  Res1  value 5k  [0402-A]
R3  Res1  value 5k  [0402-A]
R4  Res1  value 10k  [0402-A]
R5  Res1  value 10k  [0402-A]
R6  Res1  value 5k  [0402-A]
R7  Res1  value 5k  [0402-A]
R8  Res1  value 10k  [0402-A]
R9  Res1  value 10k  [0402-A]
R27  Res1  value 5k  [0402-A]
R28  Res1  value 10k  [0402-A]

### Ports
AOUT1 (in), AOUT2 (in), BOUT1 (in), BOUT2 (in), ENCODEA+ (out), ENCODEA- (out), ENCODEB+ (out), ENCODEB- (out), Limit (out)

### Nets
5V0: J2.1 J6.1
7V4: F1.1
GND: J1.1 J6.2 R4.2 R5.2 R8.2 R9.2 R28.2
EA+: J6.3 R2.2
EA-: J6.4 R6.2
EB+: J6.5 R3.2
EB-: J6.6 R7.2
NetF1_2: F1.2 J1.2
NetJ2_2: J2.2 R27.1
NetJ4_1: J4.1 ; port AOUT1
NetJ4_2: J4.2 ; port AOUT2
NetJ4_3: J4.3 ; port BOUT2
NetJ4_4: J4.4 ; port BOUT1
NetR2_1: R2.1 R4.1 ; port ENCODEA+
NetR3_1: R3.1 R5.1 ; port ENCODEB+
NetR6_1: R6.1 R8.1 ; port ENCODEA-
NetR7_1: R7.1 R9.1 ; port ENCODEB-
NetR27_2: R27.2 R28.1 ; port Limit

### Library data of the parts
F1 = Fuse 1: Fuse; Published: 8-Jun-2000; LatestRevisionDate: 17-Jul-2002; LatestRevisionNote: Re-released for DXP Platform.; PackageReference: PIN-W2/E2.8; Publisher: Altium Limited; PackageDescription: Thru-Hole; 2 Leads
J1 = 0430450212: Connector; Manufacturer_Name: Molex; Datasheet Link: http://www.molex.com/pdm_docs/sd/430450212_sd.pdf; Manufacturer_Part_Number: 0430450212; Arrow Part Number: 0430450212; Arrow Price/Stock: https://www.arrow.com/en/products/0430450212/molex
J2 = 0705530036: Connector; Manufacturer_Name: Molex; Datasheet Link: https://www.molex.com/pdm_docs/sd/705530036_sd.pdf; Height: 6.99mm; Manufacturer_Part_Number: 0705530036; Mouser Part Number: N/A; Mouser Price/Stock: https://www.mouser.com/Search/Refine.aspx?Keyword=N%2FA; Arrow Part Number: 0705530036; Arrow Price/Stock: https://www.arrow.com/en/products/0705530036/molex
J4 = 2-644486-4: Connector; Manufacturer_Name: TE Connectivity; Datasheet Link: http://www.te.com/commerce/DocumentDelivery/DDEController?Action=showdoc&DocId=Customer+Drawing%7F644486%7FL%7Fpdf%7FEnglish%7FENG_CD_644486_L_baseFilename.pdf%7F2-644486-4.pdf; Height: 10.668mm; Manufacturer_Part_Number: 2-644486-4; Mouser Part Number: 571-2-644486-4; Mouser Price/Stock: https://www.mouser.co.uk/ProductDetail/TE-Connectivity-AMP/2-644486-4?qs=8XyASyDp%2FcDn2y5ith8QSA%3D%3D; Arrow Part Number: 2-644486-4; Arrow Price/Stock: https://www.arrow.com/en/products/2-644486-4/te-connectivity
J6 = 0705530005: Connector; Manufacturer_Name: Molex; Datasheet Link: https://www.molex.com/pdm_docs/sd/705530005_sd.pdf; Height: 6.99mm; Manufacturer_Part_Number: 0705530005; Mouser Part Number: N/A; Mouser Price/Stock: https://www.mouser.co.uk/ProductDetail/Molex/0705530005?qs=PBcRNPEHKsq8dLeRN2VY7Q%3D%3D; Arrow Part Number: 0705530005; Arrow Price/Stock: https://www.arrow.com/en/products/0705530005/molex
R2-R9 R27 R28 = Res1: Resistor; Published: 8-Jun-2000; LatestRevisionDate: 17-Jul-2002; LatestRevisionNote: Re-released for DXP Platform.; PackageReference: AXIAL-0.3; Publisher: Altium Limited; PackageDescription: Axial Device, Thru-Hole; 2 Leads; 0.3 in Pin Spacing

## Sheet Temp sensor.SchDoc
size A
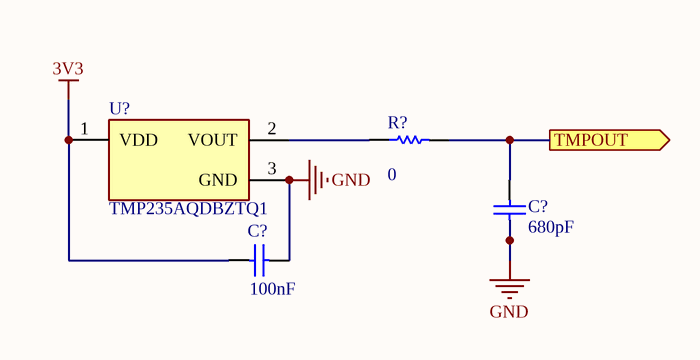
[diagram p7: Temp sensor.SchDoc]

### Parts
C17  value 680pF  [1608[0603]]  (hidden comment: Cap)
C18  value 100nF  [1608[0603]]  (hidden comment: Cap)
R10  value 0  [0402-A]  (hidden comment: Res1)
U2  TMP235AQDBZTQ1  [FP-DBZ0003A-MFG]

### Ports
TMPOUT (out)

### Nets
3V3: C18.1 U2.1(VDD)
GND: C17.2 C18.2 U2.3(GND)
NetC17_1: C17.1 R10.2 ; port TMPOUT
NetR10_1: R10.1 U2.2(VOUT)

### Library data of the parts
C17 C18 = Cap: Capacitor; Published: 8-Jun-2000; LatestRevisionDate: 17-Jul-2002; LatestRevisionNote: Re-released for DXP Platform.; PackageReference: RAD-0.3; Publisher: Altium Limited; PackageDescription: Radial Cap, Thru-Hole; 2 Leads; 0.3 in Pin Spacing
R10 = Res1: Resistor; Published: 8-Jun-2000; LatestRevisionDate: 17-Jul-2002; LatestRevisionNote: Re-released for DXP Platform.; PackageReference: AXIAL-0.3; Publisher: Altium Limited; PackageDescription: Axial Device, Thru-Hole; 2 Leads; 0.3 in Pin Spacing
U2 = CMP-04948-000003-1: LOW-POWER HIGH-ACCURACY ANALOG O; Manufacturer: Texas Instruments; Manufacturer Part Number: TMP235A2DBZR; Output Current: 500uA; Operating Supply Current: 9uA; Max Supply Voltage: 5.5V; Max Junction Temp: +150°C; Accuracy: 0.5%; Min Supply Voltage: 2.3V; Standoff Height: 0.01mm; Sensor Output: Analog Voltage; Ambient Temperature Range Low: -40°C; Device Class L2: Temperature and Humidity Sensors; Digikey Description: LOW-POWER HIGH-ACCURACY ANALOG O; Lead Free: Yes; Category: IC; Device Class L3: unset; Temperature Range Low: -40°C; ComponentLink2Description: Datasheet; Package: DBZ0003A; Octopart: https://octopart.com/tmp235a2dbzr-texas+instruments-94966376; Device Class L1: Sensors; Temperature Range High: +150°C; Height: 1.12mm; Temperature: -40°C to +150°C; RoHS: TRUE; Ambient Temperature Range High: +150°C; Automotive: No; ComponentLink2URL: http://www.ti.com/lit/ds/symlink/tmp235.pdf; Mouser Description: ±2°C Analog output temperature sensor, with 10mV /°C gain 3-SOT-23 -40 to 150

## Nets that join several sheets
3V3: 3V3 rail (7 pins), nRF52832 MCU (7 pins), Accelrometer (C19.2 C20.2 U3.5 U3.8), Temp sensor (C18.1 U2.1)
5V0: 5V0 +12V0 rails (C33.2 R11.2 U5.2 U5.4), Off-Board Connections (J2.1 J6.1)
7V4: 5V0 +12V0 rails (6 pins), 3V3 rail (C21.2 R13.2 U4.5), Off-Board Connections (F1.1)
12V0: 5V0 +12V0 rails (6 pins), Motor Controller (7 pins)
GND: 5V0 +12V0 rails (20 pins), 3V3 rail (8 pins), Motor Controller (10 pins), nRF52832 MCU (27 pins), Accelrometer (6 pins), Off-Board Connections (7 pins), Temp sensor (C17.2 C18.2 U2.3)
NetC17_1: nRF52832 MCU (U1.5), Temp sensor (C17.1 R10.2)
NetJ4_1: Motor Controller (U9.5), Off-Board Connections (J4.1)
NetJ4_2: Motor Controller (U9.7), Off-Board Connections (J4.2)
NetJ4_3: Motor Controller (U9.8), Off-Board Connections (J4.3)
NetJ4_4: Motor Controller (U9.10), Off-Board Connections (J4.4)
NetR2_1: nRF52832 MCU (U1.43), Off-Board Connections (R2.1 R4.1)
NetR3_1: nRF52832 MCU (U1.41), Off-Board Connections (R3.1 R5.1)
NetR6_1: nRF52832 MCU (U1.42), Off-Board Connections (R6.1 R8.1)
NetR7_1: nRF52832 MCU (U1.40), Off-Board Connections (R7.1 R9.1)
NetR27_2: nRF52832 MCU (U1.4), Off-Board Connections (R27.2 R28.1)
NetR29_2: Motor Controller (R29.2 U9.27), nRF52832 MCU (U1.12)
NetR30_2: Motor Controller (R30.2 U9.18), nRF52832 MCU (U1.22)
NetU1_8: nRF52832 MCU (U1.8), Accelrometer (U3.1)
NetU1_9: nRF52832 MCU (U1.9), Accelrometer (U3.14)
NetU1_10: nRF52832 MCU (U1.10), Accelrometer (U3.13)
NetU1_11: nRF52832 MCU (U1.11), Accelrometer (U3.12)
NetU1_14: Motor Controller (U9.26), nRF52832 MCU (U1.14)
NetU1_15: Motor Controller (U9.25), nRF52832 MCU (U1.15)
NetU1_16: Motor Controller (U9.24), nRF52832 MCU (U1.16)
NetU1_17: Motor Controller (U9.22), nRF52832 MCU (U1.17)
NetU1_18: Motor Controller (U9.21), nRF52832 MCU (U1.18)
NetU1_19: Motor Controller (U9.20), nRF52832 MCU (U1.19)
NetU1_20: Motor Controller (U9.19), nRF52832 MCU (U1.20)
NetU1_23: Motor Controller (U9.17), nRF52832 MCU (U1.23)
NetU1_27: Motor Controller (U9.16), nRF52832 MCU (U1.27)